# Altium schematic sheet 540and2104.SchDoc
size 381 x 381 mm
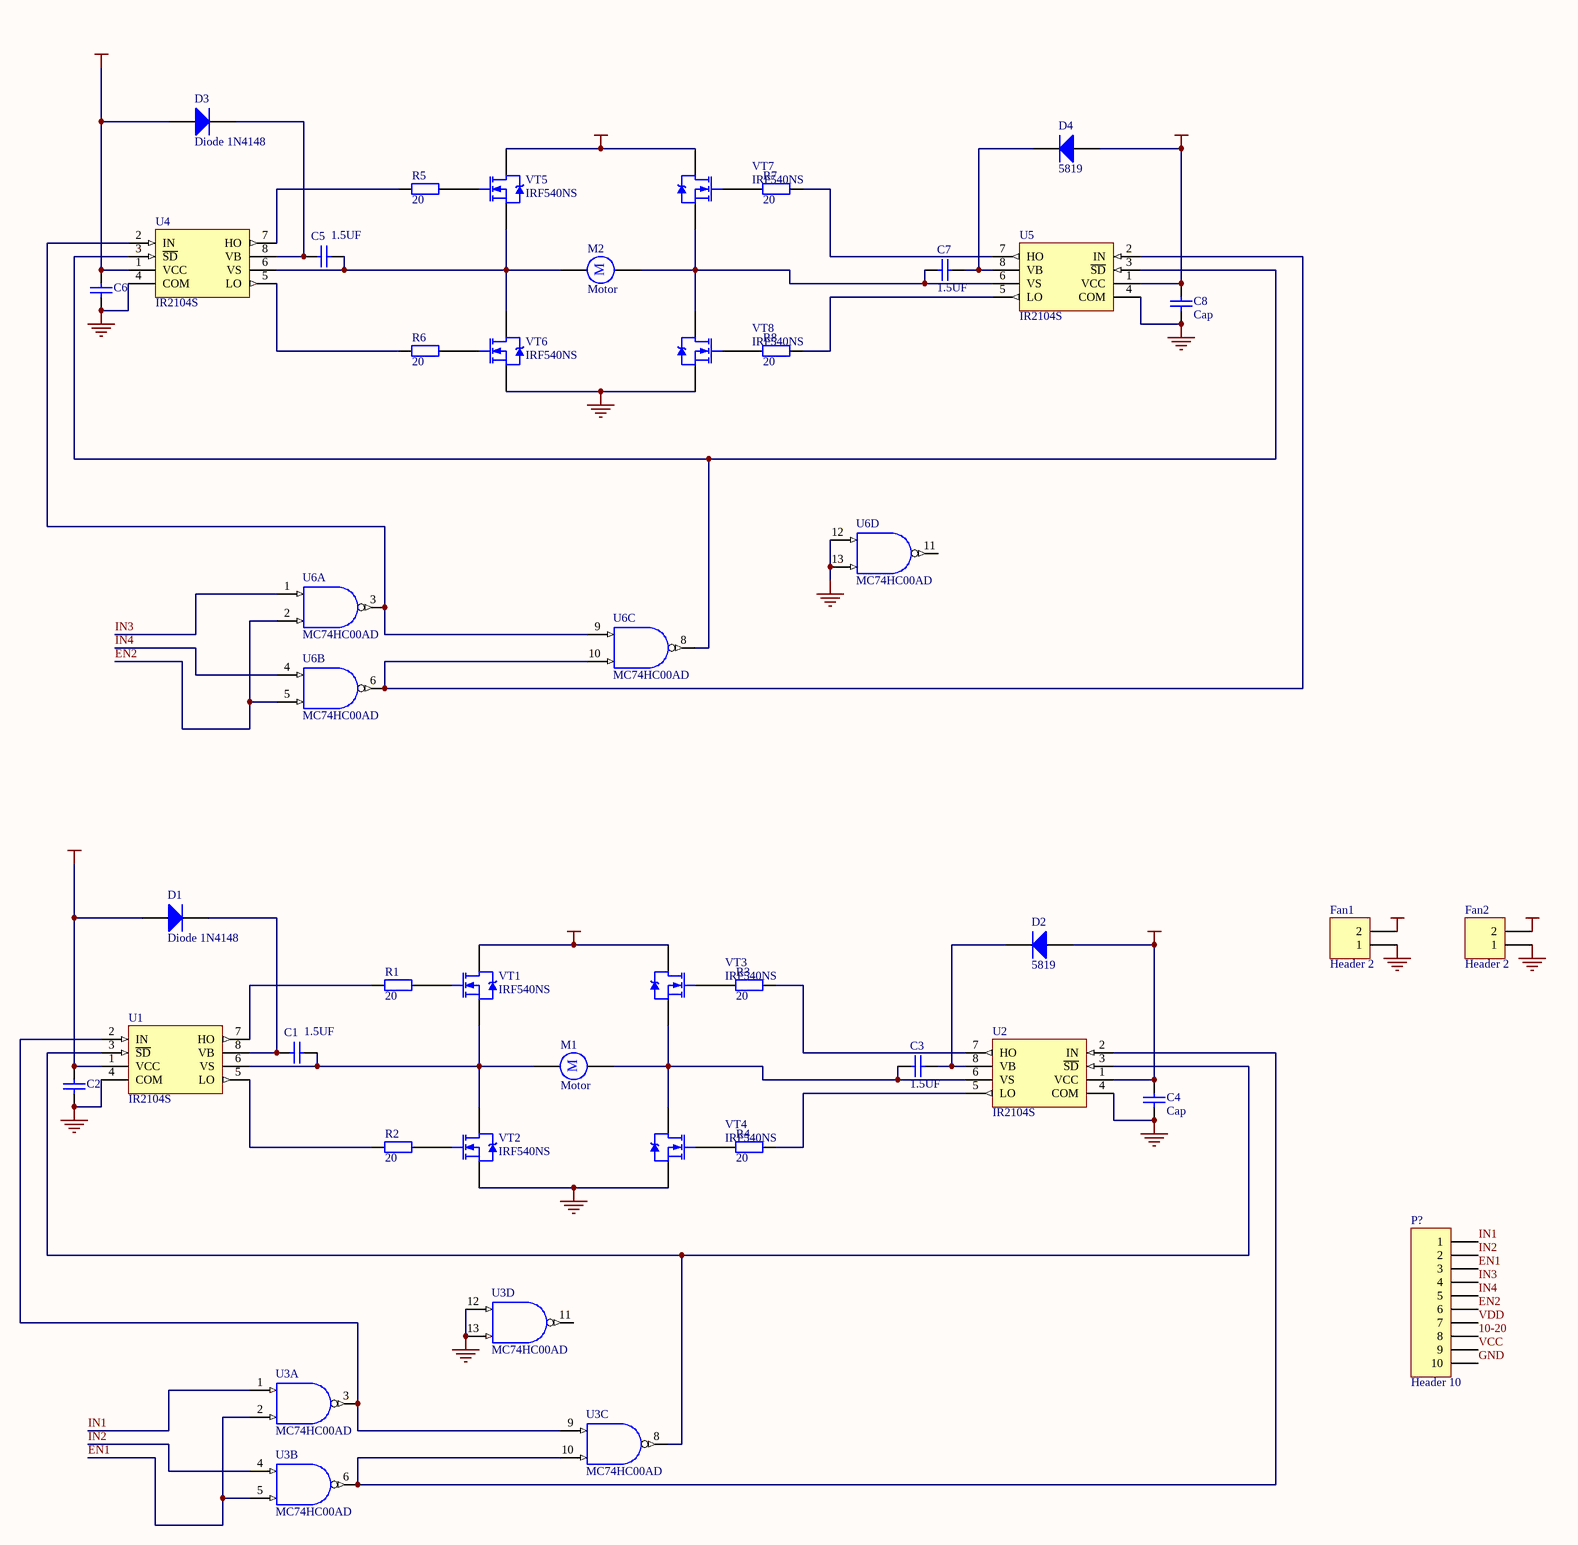
[diagram p0: 540and2104.SchDoc]

## Parts
C1  1.5UF  [CC3216-1206]
C2  (no value)  [CR2012-0805]
C3  1.5UF  [CC3216-1206]
C4  Cap  [CR2012-0805]
C5  1.5UF  [CC3216-1206]
C6  (no value)  [CR2012-0805]
C7  1.5UF  [CC3216-1206]
C8  Cap  [CR2012-0805]
D1  Diode 1N4148  [CC3216-1206]
D2  5819  [CC3216-1206]
D3  Diode 1N4148  [CC3216-1206]
D4  5819  [CC3216-1206]
Fan1  Header 2  [HDR1X2]
Fan2  Header 2  [HDR1X2]
M1  Motor  [HDR1X2H]
M2  Motor  [HDR1X2H]
P?  Header 10  [HDR1X10]
R1  20  [CR2012-0805]
R2  20  [CR2012-0805]
R3  20  [CR2012-0805]
R4  20  [CR2012-0805]
R5  20  [CR2012-0805]
R6  20  [CR2012-0805]
R7  20  [CR2012-0805]
R8  20  [CR2012-0805]
U1  IR2104S  [SO-8]
U2  IR2104S  [SO-8]
U3  MC74HC00AD  [751A-02]  (parts A,B,C,D of 4)
U4  IR2104S  [SO-8]
U5  IR2104S  [SO-8]
U6  MC74HC00AD  [751A-02]  (parts A,B,C,D of 4)
VT1  IRF540NS  [D2PAK]
VT2  IRF540NS  [D2PAK]
VT3  IRF540NS  [D2PAK]
VT4  IRF540NS  [D2PAK]
VT5  IRF540NS  [D2PAK]
VT6  IRF540NS  [D2PAK]
VT7  IRF540NS  [D2PAK]
VT8  IRF540NS  [D2PAK]

## Nets
10-20: C2.1 C4.1 C6.1 C8.1 D1.1(A) D2.1(A) D3.1(A) D4.1(A) P?.8 U1.1(VCC) U2.1(VCC) U4.1(VCC) U5.1(VCC)
GND: C2.2 C4.2 C6.2 C8.2 Fan1.1 Fan2.1 P?.10 U1.4(COM) U2.4(COM) U3.7(GND) U3.12(A) U3.13(B) U4.4(COM) U5.4(COM) U6.7(GND) U6.12(A) U6.13(B) VT2.3(S) VT4.3(S) VT6.3(S) VT8.3(S)
VCC: P?.9 VT1.2(D) VT3.2(D) VT5.2(D) VT7.2(D)
VDD: Fan1.2 Fan2.2 P?.7 U3.14(VDD) U6.14(VDD)
EN1: P?.3 U3.2(B) U3.5(B)
EN2: P?.6 U6.2(B) U6.5(B)
IN1: P?.1 U3.1(A)
IN2: P?.2 U3.4(A)
IN3: P?.4 U6.1(A)
IN4: P?.5 U6.4(A)
NetC1_1: C1.1 D1.2(K) U1.8(VB)
NetC1_2: C1.2 M1.1 U1.6(VS) VT1.3(S) VT2.2(D)
NetC3_1: C3.1 M1.2 U2.6(VS) VT3.3(S) VT4.2(D)
NetC3_2: C3.2 D2.2(K) U2.8(VB)
NetC5_1: C5.1 D3.2(K) U4.8(VB)
NetC5_2: C5.2 M2.1 U4.6(VS) VT5.3(S) VT6.2(D)
NetC7_1: C7.1 M2.2 U5.6(VS) VT7.3(S) VT8.2(D)
NetC7_2: C7.2 D4.2(K) U5.8(VB)
NetR1_1: R1.1 U1.7(HO)
NetR1_2: R1.2 VT1.1(G)
NetR2_1: R2.1 U1.5(LO)
NetR2_2: R2.2 VT2.1(G)
NetR3_1: R3.1 VT3.1(G)
NetR3_2: R3.2 U2.7(HO)
NetR4_1: R4.1 VT4.1(G)
NetR4_2: R4.2 U2.5(LO)
NetR5_1: R5.1 U4.7(HO)
NetR5_2: R5.2 VT5.1(G)
NetR6_1: R6.1 U4.5(LO)
NetR6_2: R6.2 VT6.1(G)
NetR7_1: R7.1 VT7.1(G)
NetR7_2: R7.2 U5.7(HO)
NetR8_1: R8.1 VT8.1(G)
NetR8_2: R8.2 U5.5(LO)
NetU1_2: U1.2(IN) U3.3(Y) U3.9(A)
NetU1_3: U1.3(~{SD}) U2.3(~{SD}) U3.8(Y)
NetU2_2: U2.2(IN) U3.6(Y) U3.10(B)
NetU4_2: U4.2(IN) U6.3(Y) U6.9(A)
NetU4_3: U4.3(~{SD}) U5.3(~{SD}) U6.8(Y)
NetU5_2: U5.2(IN) U6.6(Y) U6.10(B)

Not connected (* = marked no-connect by the designer): U3 11(Y); U6 11(Y)

## Notes on the sheet
- (in symbol Motor) M

## Library data of the parts
C1 C5 = Cap Semi: Capacitor (Semiconductor SIM Model); Published: 8-Jun-2000; LatestRevisionDate: 17-Jul-2002; LatestRevisionNote: Re-released for DXP Platform.; Publisher: Altium Limited; PackageReference: C1206
C2 C4 C6 C8 = Cap: 104; Published: 8-Jun-2000; LatestRevisionDate: 17-Jul-2002; LatestRevisionNote: Re-released for DXP Platform.; Publisher: Altium Limited
C3 C7 = Cap: Capacitor; Published: 8-Jun-2000; LatestRevisionDate: 17-Jul-2002; LatestRevisionNote: Re-released for DXP Platform.; Publisher: Altium Limited
D1-D4 = Diode 1N4148: High Conductance Fast Diode; Published: 8-Jun-2000; LatestRevisionDate: 17-Jul-2002; LatestRevisionNote: Re-released for DXP Platform.; PackageReference: DO-35; Publisher: Altium Limited; Code_JEDEC: DO-204-AH; DatasheetDocument: 1997; ComponentLink1Description: Manufacturer Link; ComponentLink1URL: http://www.fairchildsemi.com/
Fan1 Fan2 = Header 2: Header, 2-Pin; LatestRevisionDate: 17-Jul-2002; LatestRevisionNote: Re-released for DXP Platform.; Publisher: Altium Limited
M1 M2 = Motor: Motor, General Kind; Published: 24-Mar-1999; LatestRevisionDate: 17-Jul-2002; LatestRevisionNote: Re-released for DXP Platform.; Publisher: Altium Limited
P? = Header 10: Header, 10-Pin; LatestRevisionDate: 17-Jul-2002; LatestRevisionNote: Re-released for DXP Platform.; Publisher: Altium Limited
R1-R8 = Res2: Resistor; Published: 8-Jun-2000; LatestRevisionDate: 17-Jul-2002; LatestRevisionNote: Re-released for DXP Platform.; Publisher: Altium Limited
U1 U2 U4 U5 = IR2104S: High and Low Side Driver; Published: 8-Jun-2000; LatestRevisionDate: 4-Mar-2005; LatestRevisionNote: Stylized 3D Model Added.; DatasheetDocument: PD600461; PackageReference: SO-8; Publisher: Altium Limited; Code_JEDEC: MS-012-AA; ComponentLink1Description: Manufacturer Link; ComponentLink1URL: http://www.irf.com/; PackageDocument: 22-Feb-2001
U3 U6 = MC74HC00AD: Quad 2-Input NAND Gate; PackageDocument: 1991; Published: 17-Jul-2002; LatestRevisionDate: 6-Jun-2005; LatestRevisionNote: Stylized 3D Model Added; DatasheetDocument: 1989; PackageReference: 751A-02; Publisher: Altium Limited; ComponentLink1Description: Manufacturer Link; ComponentLink1URL: http://www.motorola.com/
VT1-VT8 = IRF540NS: HEXFET Power MOSFET; Published: 8-Jun-2000; LatestRevisionDate: 17-Jul-2002; LatestRevisionNote: Re-released for DXP Platform.; DatasheetDocument: May-1998; PackageReference: D2PAK; Publisher: Altium Limited; ComponentLink1Description: Manufacturer Link; ComponentLink1URL: http://www.irf.com/